# Altium project XUF208_Clock.PrjPcb
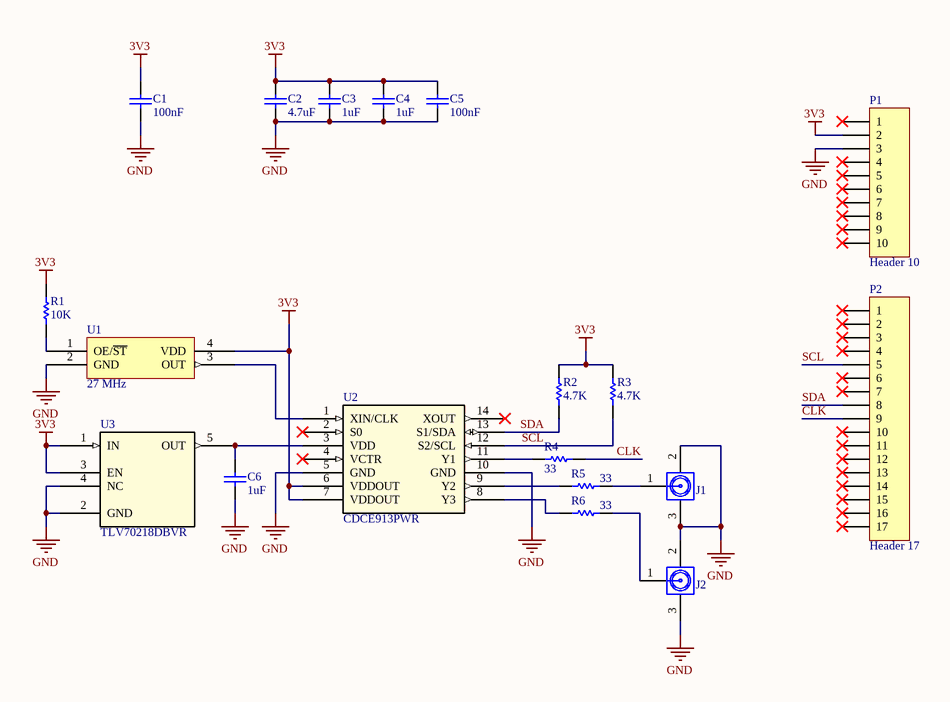
[diagram p0: pll.SchDoc]
1 sheet, 19 parts. Net scope: global (net labels, ports and power ports of the same name join across sheets).
Board file: XUF208_Clock.PcbDoc

## Sheet pll.SchDoc
size A4

### Parts
C1  value 100nF  [CAP_0603]  (hidden comment: MLCC)
C2  value 4.7uF  [CAP_0603]  (hidden comment: MLCC)
C3  value 1uF  [CAP_0603]  (hidden comment: MLCC)
C4  value 1uF  [CAP_0603]  (hidden comment: MLCC)
C5  value 100nF  [CAP_0603]  (hidden comment: MLCC)
C6  value 1uF  [CAP_0603]  (hidden comment: MLCC)
J1  RF Connector  [RF CONNECTOR (1)]  (value not drawn)
J2  RF Connector  [RF CONNECTOR (1)]  (value not drawn)
P1  Header 10  [HDR1X10]
P2  Header 17  [HDR1X17]
R1  value 10K  [RC0603N]  (hidden comment: RES)
R2  value 4.7K  [RC0603N]  (hidden comment: RES)
R3  value 4.7K  [RC0603N]  (hidden comment: RES)
R4  value 33  [RC0603N]  (hidden comment: RES)
R5  value 33  [RC0603N]  (hidden comment: RES)
R6  value 33  [RC0603N]  (hidden comment: RES)
U1  Frequency: 27 MHz  [QFN_3225_4P]  (hidden comment: XO)
U2  Manufacturer_Part_Number: CDCE913PWR  [PW14]  (hidden comment: CDCE913)
U3  TLV70218DBVR  [DBV5]

### Nets
3V3: C1.2 C2.2 C3.2 C4.2 C5.2 P1.2 R1.2 R2.2 R3.2 U1.4(VDD) U2.6(VDDOUT) U2.7(VDDOUT) U3.1(IN) U3.3(EN)
GND: C1.1 C2.1 C3.1 C4.1 C5.1 C6.1 J1.2(GND) J1.3(GND) J2.2(GND) J2.3(GND) P1.3 U1.2(GND) U2.5(GND) U2.10(GND) U3.2(GND) U3.4(NC)
CLK: P2.9 R4.1
SCL: P2.5 R3.1 U2.12(S2/SCL)
SDA: P2.8 R2.1 U2.13(S1/SDA)
NetC6_2: C6.2 U2.3(VDD) U3.5(OUT)
NetJ1_1: J1.1(SIG) R5.1
NetJ2_1: J2.1(SIG) R6.1
NetR1_1: R1.1 U1.1(OE/~{ST})
NetR4_2: R4.2 U2.11(Y1)
NetR5_2: R5.2 U2.9(Y2)
NetR6_2: R6.2 U2.8(Y3)
NetU1_3: U1.3(OUT) U2.1(XIN/CLK)

Not connected (* = marked no-connect by the designer): P1 1* 4* 5* 6* 7* 8* 9* 10*; P2 1* 2* 3* 4* 6* 7* 10* 11* 12* 13* 14* 15* 16* 17*; U2 2(S0)* 4(VCTR)* 14(XOUT)*

### Library data of the parts
C1-C6 = MLCC: Multilayer Ceramic Capacitors; VoltageRatingDC: 5V; Tolerance: 10%
J1 J2 = RF Connector: VAO ITEM, MINI RF HEADER; Built_By: Gordon Mak
P1 = Header 10: Header, 10-Pin; LatestRevisionDate: 17-Jul-2002; LatestRevisionNote: Re-released for DXP Platform.; Publisher: Altium Limited
P2 = Header 17: Header, 17-Pin; LatestRevisionDate: 17-Jul-2002; LatestRevisionNote: Re-released for DXP Platform.; Publisher: Altium Limited
R1-R6 = RES: Chip Resistors; PowerRating: 0.25W
U1 = XO: SiTime Ultra Performance Oscillator; Manufacturer: SiTime; ComponentLink1Description: Manufacturer URL; ComponentLink1URL: https://www.sitime.com; ComponentLink2Description: Datasheet; ComponentLink2URL: https://www.sitime.com/datasheet/SiT8208
U2 = CDCE913: CDCE(L)913: Flexible Low Power LVCMOS Clock Generator With SSC Support for EMI Reduction; Manufacturer: Texas Instruments; Built_By: EMA_UL_Team; Copyright: Copyright (C) 2018 Accelerated Designs. All rights reserved; RefDes: RefDes; Type: DEV; Value: Value
U3 = TLV702: TLV702 300-mA, Low-IQ, Low-Dropout Regulator; Manufacturer: Texas Instruments; Manufacturer_Part_Number: TLV70212DBVR; Built_By: Gordon Mak; Copyright: Copyright (C) 2020 MWLabs. All rights reserved; RefDes: RefDes; Type: DEV; Value: Value